# EAGLE board CoCoQuadLink (EAGLE 7.7.0)
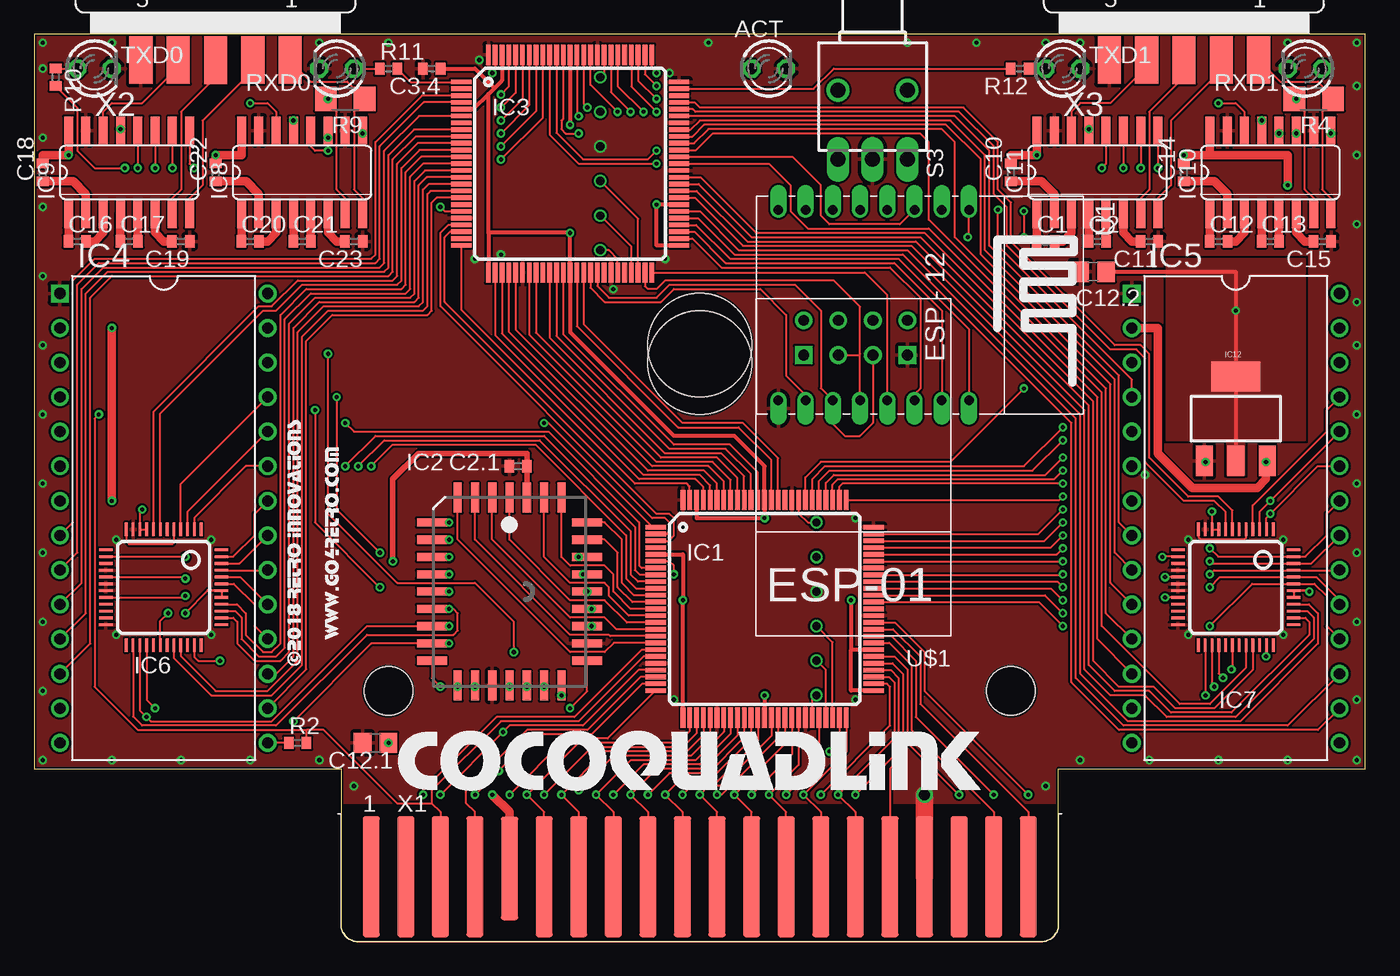
[diagram p7: board, top side]
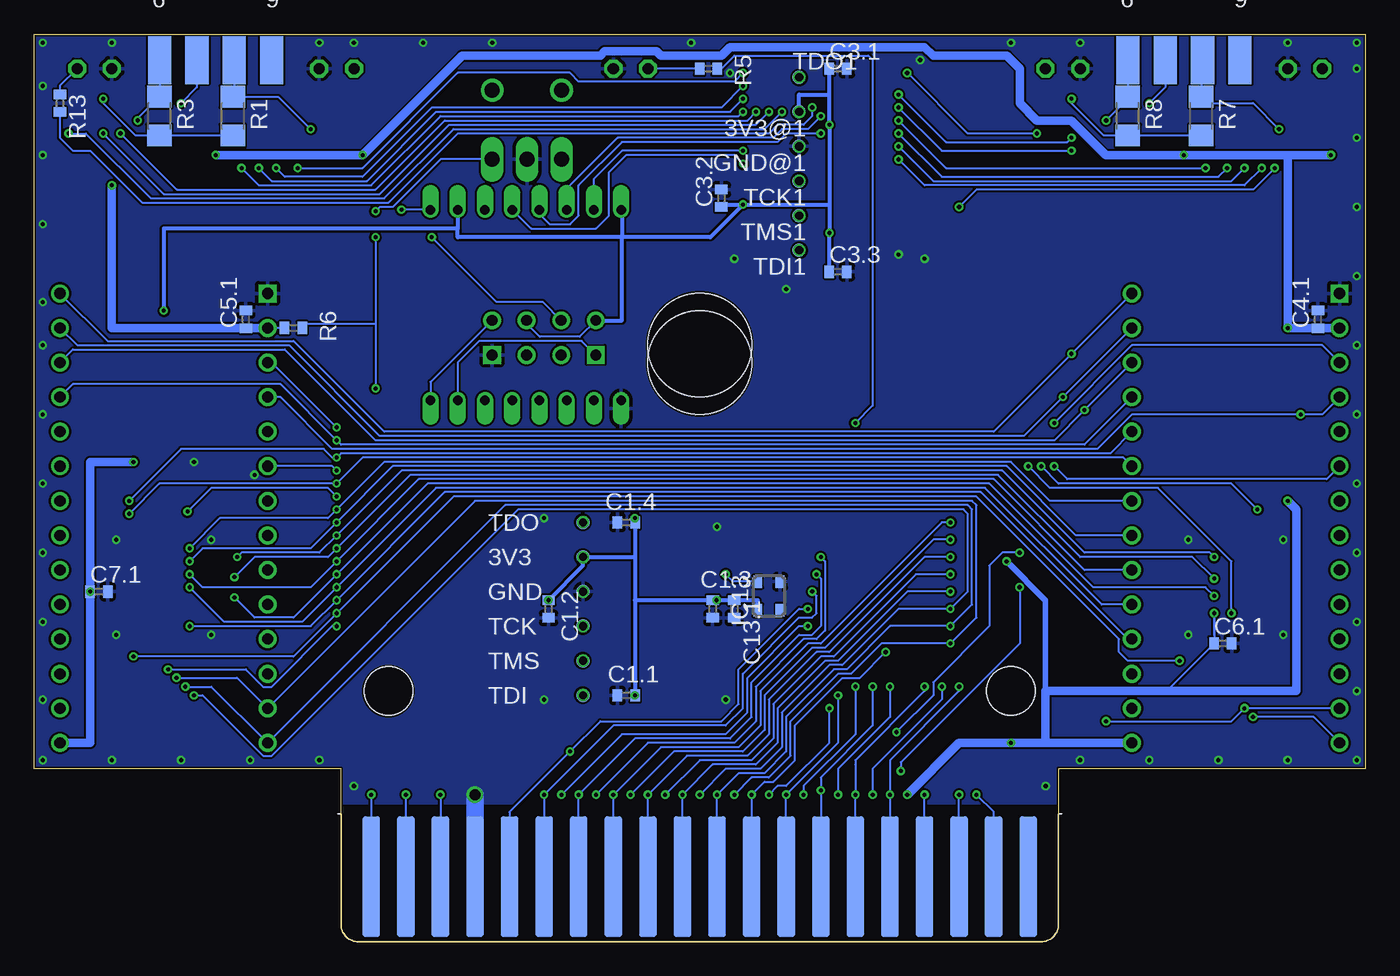
[diagram p8: board, bottom side, seen from below]

Size 97.79 x 66.67 mm. Coordinates in mm from the lower left corner, seen from the top.
Outline: 97.79,66.67 0,66.67 0,12.7 22.54,12.7 22.54,1.27 arc90 23.81,0 73.98,0 arc90 75.25,1.27 75.25,12.7 97.79,12.7 97.79,66.67
Copper layers (1*16): Top 0.035mm / dielectric 1.5mm / Bottom 0.035mm
Design rules "hackvana *": minimum track width 6mil, minimum drill 0.3mm, track to track 6mil, track to pad 6mil, pad to pad 6mil, via to via 6mil, smd to smd 0mil, copper to edge 6mil, drill to drill 6mil, minimum pad ring 10mil, minimum via ring 6mil, stop-mask expansion 2mil, vias tented up to drill 100mil, thermal gap 10mil

## Footprints (pad centres in the part's own frame; a part is rotated, then mirrored left to right if it is on the bottom)
TP10R = smd 1 x 1: TP 0,0
LED3MM = drill 0.813 octagon: A -1.27,0; K 1.27,0
C0402 = smd 0.7 x 0.9: 1 -0.65,0; 2 0.65,0
C0805 = smd 1.3 x 1.5: 1 -0.95,0; 2 0.95,0
TQFP100 = smd 1.5 x 0.35: 1 -8,6; 2 -8,5.5; 3 -8,5; 4 -8,4.5; 5 -8,4; 6 -8,3.5; 7 -8,3; 8 -8,2.5; 9 -8,2; 10 -8,1.5; 11 -8,1; 12 -8,0.5; 13 -8,0; 14 -8,-0.5; 15 -8,-1; 16 -8,-1.5; 17 -8,-2; 18 -8,-2.5; 19 -8,-3; 20 -8,-3.5; 21 -8,-4; 22 -8,-4.5; 23 -8,-5; 24 -8,-5.5; 25 -8,-6; 51 8,-6; 52 8,-5.5; 53 8,-5; 54 8,-4.5; 55 8,-4; 56 8,-3.5; 57 8,-3; 58 8,-2.5; 59 8,-2; 60 8,-1.5; 61 8,-1; 62 8,-0.5; 63 8,0; 64 8,0.5; 65 8,1; 66 8,1.5; 67 8,2; 68 8,2.5; 69 8,3; 70 8,3.5; 71 8,4; 72 8,4.5; 73 8,5; 74 8,5.5; 75 8,6 | smd 0.35 x 1.5: 26 -6,-8; 27 -5.5,-8; 28 -5,-8; 29 -4.5,-8; 30 -4,-8; 31 -3.5,-8; 32 -3,-8; 33 -2.5,-8; 34 -2,-8; 35 -1.5,-8; 36 -1,-8; 37 -0.5,-8; 38 0,-8; 39 0.5,-8; 40 1,-8; 41 1.5,-8; 42 2,-8; 43 2.5,-8; 44 3,-8; 45 3.5,-8; 46 4,-8; 47 4.5,-8; 48 5,-8; 49 5.5,-8; 50 6,-8; 76 6,8; 77 5.5,8; 78 5,8; 79 4.5,8; 80 4,8; 81 3.5,8; 82 3,8; 83 2.5,8; 84 2,8; 85 1.5,8; 86 1,8; 87 0.5,8; 88 0,8; 89 -0.5,8; 90 -1,8; 91 -1.5,8; 92 -2,8; 93 -2.5,8; 94 -3,8; 95 -3.5,8; 96 -4,8; 97 -4.5,8; 98 -5,8; 99 -5.5,8; 100 -6,8
PLCC32R = smd 0.6 x 2.2: 1 0,6.9; 2 -1.27,6.9; 3 -2.54,6.9; 4 -3.81,6.9; 14 -3.81,-6.9; 15 -2.54,-6.9; 16 -1.27,-6.9; 17 0,-6.9; 18 1.27,-6.9; 19 2.54,-6.9; 20 3.81,-6.9; 30 3.81,6.9; 31 2.54,6.9; 32 1.27,6.9 | smd 2.2 x 0.6: 5 -5.7,5.08; 6 -5.7,3.81; 7 -5.7,2.54; 8 -5.7,1.27; 9 -5.7,0; 10 -5.7,-1.27; 11 -5.7,-2.54; 12 -5.7,-3.81; 13 -5.7,-5.08; 21 5.7,-5.08; 22 5.7,-3.81; 23 5.7,-2.54; 24 5.7,-1.27; 25 5.7,0; 26 5.7,1.27; 27 5.7,2.54; 28 5.7,3.81; 29 5.7,5.08
DIL28-ROUNDPAD = drill 0.813 square: 1 -16.51,-7.62 | drill 0.813: 2 -13.97,-7.62; 3 -11.43,-7.62; 4 -8.89,-7.62; 5 -6.35,-7.62; 6 -3.81,-7.62; 7 -1.27,-7.62; 8 1.27,-7.62; 9 3.81,-7.62; 10 6.35,-7.62; 11 8.89,-7.62; 12 11.43,-7.62; 13 13.97,-7.62; 14 16.51,-7.62; 15 16.51,7.62; 16 13.97,7.62; 17 11.43,7.62; 18 8.89,7.62; 19 6.35,7.62; 20 3.81,7.62; 21 1.27,7.62; 22 -1.27,7.62; 23 -3.81,7.62; 24 -6.35,7.62; 25 -8.89,7.62; 26 -11.43,7.62; 27 -13.97,7.62; 28 -16.51,7.62
LQFP48 = smd 0.2 x 1: 1 -2.75,-4.25; 2 -2.25,-4.25; 3 -1.75,-4.25; 4 -1.25,-4.25; 5 -0.75,-4.25; 6 -0.25,-4.25; 7 0.25,-4.25; 8 0.75,-4.25; 9 1.25,-4.25; 10 1.75,-4.25; 11 2.25,-4.25; 12 2.75,-4.25; 25 2.75,4.25; 26 2.25,4.25; 27 1.75,4.25; 28 1.25,4.25; 29 0.75,4.25; 30 0.25,4.25; 31 -0.25,4.25; 32 -0.75,4.25; 33 -1.25,4.25; 34 -1.75,4.25; 35 -2.25,4.25; 36 -2.75,4.25 | smd 1 x 0.2: 13 4.25,-2.75; 14 4.25,-2.25; 15 4.25,-1.75; 16 4.25,-1.25; 17 4.25,-0.75; 18 4.25,-0.25; 19 4.25,0.25; 20 4.25,0.75; 21 4.25,1.25; 22 4.25,1.75; 23 4.25,2.25; 24 4.25,2.75; 37 -4.25,2.75; 38 -4.25,2.25; 39 -4.25,1.75; 40 -4.25,1.25; 41 -4.25,0.75; 42 -4.25,0.25; 43 -4.25,-0.25; 44 -4.25,-0.75; 45 -4.25,-1.25; 46 -4.25,-1.75; 47 -4.25,-2.25; 48 -4.25,-2.75
SO16 = smd 0.66 x 2.032: 1 -4.445,-3.073; 2 -3.175,-3.073; 3 -1.905,-3.073; 4 -0.635,-3.073; 5 0.635,-3.073; 6 1.905,-3.073; 7 3.175,-3.073; 8 4.445,-3.073; 9 4.445,3.073; 10 3.175,3.073; 11 1.905,3.073; 12 0.635,3.073; 13 -0.635,3.073; 14 -1.905,3.073; 15 -3.175,3.073; 16 -4.445,3.073
SOT223 = smd 1.219 x 2.235: 1 -2.311,-3.099; 2 0,-3.099; 3 2.311,-3.099 | smd 3.6 x 2.2: 4 0,3.099
ASE = smd 0.9 x 0.65: 1 -1.05,-0.825; 2 1.05,-0.825; 3 1.05,0.825; 4 -1.05,0.825
PROGRAM_PAK = hole 7.62: 0,1.27; 0,0 | hole 3.556: -22.86,-24.13; 22.86,-24.13
R1206 = smd 1.6 x 1.803: 1 -1.422,0; 2 1.422,0
R0402 = smd 0.7 x 0.9: 1 -0.65,0; 2 0.65,0
TL3XWO = drill 1.1 pad 1.422 long: 1 -2.54,-5.08; 2 0,-5.08; 3 2.54,-5.08 | drill 1.1 pad 1.676: M1 -2.54,0; M2 2.54,0
ESP12 = drill 0.7 offset: ADC -7.1,3.8; CH_PD -7.1,1.8; GND 6.9,-8.2; GPIO0 6.9,-2.2; GPIO2 6.9,-4.2; GPIO4 6.9,1.8; GPIO5 6.9,-0.2; GPIO12 -7.1,-4.2; GPIO13 -7.1,-6.2; GPIO14 -7.1,-2.2; GPIO15 6.9,-6.2; GPIO16 -7.1,-0.2; RESET -7.1,5.8; RX 6.9,3.8; TX 6.9,5.8; VCC -7.1,-8.2
ESP01 = drill 0.8: CH_PD -1.285,-8.178; GPIO0 1.255,-5.638; GPIO2 -1.285,-5.638; RST 1.255,-8.178; TX -3.825,-8.178; VCC 3.795,-8.178 | drill 0.8 square: GND -3.825,-5.638; RX 3.795,-5.638
MA20-2 = smd 1.27 x 8.89: 1 -24.13,-0.305; 3 -21.59,-0.305; 5 -19.05,-0.305; 7 -16.51,-0.305; 11 -11.43,-0.305; 13 -8.89,-0.305; 15 -6.35,-0.305; 17 -3.81,-0.305; 19 -1.27,-0.305; 21 1.27,-0.305; 23 3.81,-0.305; 25 6.35,-0.305; 27 8.89,-0.305; 29 11.43,-0.305; 31 13.97,-0.305; 33 16.51,-0.305; 35 19.05,-0.305; 37 21.59,-0.305; 39 24.13,-0.305 | smd 1.27 x 8.89 bottom: 2 -24.13,-0.305; 4 -21.59,-0.305; 6 -19.05,-0.305; 8 -16.51,-0.305; 10 -13.97,-0.305; 12 -11.43,-0.305; 14 -8.89,-0.305; 16 -6.35,-0.305; 18 -3.81,-0.305; 20 -1.27,-0.305; 22 1.27,-0.305; 24 3.81,-0.305; 26 6.35,-0.305; 28 8.89,-0.305; 30 11.43,-0.305; 32 13.97,-0.305; 34 16.51,-0.305; 36 19.05,-0.305; 38 21.59,-0.305; 40 24.13,-0.305 | smd 1.27 x 7.62: 9 -13.97,0.305
M09D = smd 1.7 x 3.5: 1 5.486,-6.045; 2 2.743,-6.045; 3 0,-6.045; 4 -2.743,-6.045; 5 -5.486,-6.045 | smd 1.7 x 3.5 bottom: 6 4.115,-6.045; 7 1.372,-6.045; 8 -1.372,-6.045; 9 -4.115,-6.045

## Placement (x,y rotation side)
3V3  TPTP10R  [TP10R]  57.47,28.26 90 bottom
3V3@1  TPTP10R  [TP10R]  41.59,60.96 180 bottom
ACT  [LED3MM]  53.98,64.14 0 top
C1  0.1uf  [C0402]  74.3,51.44 0 top
C1.1  .1  [C0402]  54.29,18.1 180 bottom
C1.2  .1  [C0402]  60.01,24.45 270 bottom
C1.3  .1  [C0402]  47.94,24.45 270 bottom
C1.4  .1  [C0402]  54.29,30.8 180 bottom
C2  0.1uf  [C0402]  78.11,51.44 0 top
C2.1  .1  [C0402]  35.56,34.92 180 top
C3.1  .1  [C0402]  38.73,64.14 0 bottom
C3.2  .1  [C0402]  47.31,54.61 90 bottom
C3.3  .1  [C0402]  38.73,49.21 0 bottom
C3.4  .1  [C0402]  29.21,64.14 180 top
C4.1  .1  [C0402]  3.49,45.72 90 bottom
C5.1  .1  [C0402]  82.23,45.72 90 bottom
C6.1  .1  [C0402]  10.48,21.91 0 bottom
C7.1  .1  [C0402]  93.03,25.72 0 bottom
C10  0.1uF  [C0402]  71.75,56.52 90 top
C11  0.1uf  [C0402]  81.92,51.44 180 top
C12  0.1uf  [C0402]  87,51.44 0 top
C12.1  10  [C0805]  25.08,14.61 180 top
C12.2  22  [C0805]  77.79,49.21 180 top
C13  0.1uf  [C0402]  90.81,51.44 0 top
C13.1  .1  [C0402]  46.36,24.45 270 bottom
C14  0.1uF  [C0402]  84.46,56.52 90 top
C15  0.1uf  [C0402]  94.62,51.44 180 top
C16  0.1uf  [C0402]  3.18,51.44 0 top
C17  0.1uf  [C0402]  6.99,51.44 0 top
C18  0.1uF  [C0402]  0.64,56.52 90 top
C19  0.1uf  [C0402]  10.8,51.44 180 top
C20  0.1uf  [C0402]  15.88,51.44 0 top
C21  0.1uf  [C0402]  19.69,51.44 0 top
C22  0.1uF  [C0402]  13.34,56.52 90 top
C23  0.1uf  [C0402]  23.5,51.44 180 top
GND  TPTP10R  [TP10R]  57.47,25.72 90 bottom
GND@1  TPTP10R  [TP10R]  41.59,58.42 180 bottom
IC1  XC95144XLTQG100  [TQFP100]  53.66,24.45 0 top
IC2  AM29F040J  [PLCC32R]  34.93,25.72 0 top
IC3  XC9572XLTQG100  [TQFP100]  39.37,57.15 0 top
IC4  65X51A  [DIL28-ROUNDPAD]  9.53,31.11 270 top
IC5  65X51A  [DIL28-ROUNDPAD]  88.27,31.11 270 top
IC6  ST16C550  [LQFP48]  9.53,26.04 180 top
IC7  TL16C550  [LQFP48]  88.27,26.04 180 top
IC8  MAX232  [SO16]  19.69,56.52 0 top
IC9  MAX232  [SO16]  6.99,56.52 0 top
IC10  MAX232  [SO16]  90.81,56.52 0 top
IC11  MAX232  [SO16]  78.11,56.52 0 top
IC12  [SOT223]  88.27,38.42 0 top
IC13  ASE  [ASE]  43.82,25.4 90 bottom
PAK  [PROGRAM_PAK]  48.9,42.55 0 top
R1  4.7K  [R1206]  83.19,60.64 270 bottom
R2  10K  [R0402]  19.37,14.61 180 top
R3  4.7K  [R1206]  88.58,60.64 270 bottom
R4  4.7K  [R1206]  93.98,61.91 180 top
R5  [R0402]  48.26,64.14 0 bottom
R6  10K  [R0402]  78.74,45.09 180 bottom
R7  4.7K  [R1206]  12.07,60.64 270 bottom
R8  4.7K  [R1206]  17.46,60.64 270 bottom
R9  4.7K  [R1206]  22.86,61.91 180 top
R10  [R0402]  1.59,63.5 270 top
R11  [R0402]  26.04,64.14 0 top
R12  [R0402]  72.39,64.14 180 top
R13  [R0402]  95.89,61.59 270 bottom
RXD0  [LED3MM]  22.23,64.14 180 top
RXD1  [LED3MM]  93.34,64.14 180 top
S3  TL36WO  [TL3XWO]  61.59,62.55 0 top
TCK  TPTP10R  [TP10R]  57.47,23.18 90 bottom
TCK1  TPTP10R  [TP10R]  41.59,55.88 180 bottom
TDI  TPTP10R  [TP10R]  57.47,18.1 90 bottom
TDI1  TPTP10R  [TP10R]  41.59,50.8 180 bottom
TDO  TPTP10R  [TP10R]  57.47,30.8 90 bottom
TDO1  TPTP10R  [TP10R]  41.59,63.5 0 bottom
TMS  TPTP10R  [TP10R]  57.47,20.64 0 bottom
TMS1  TPTP10R  [TP10R]  41.59,53.34 180 bottom
TXD0  [LED3MM]  4.45,64.14 0 top
TXD1  [LED3MM]  75.56,64.14 0 top
U1  ESP-12e  [ESP12]  62.87,46.67 270 top
U$1  ESP01  [ESP01]  60.33,37.47 180 top
X1  EXPANSION_PORT_COCO  [MA20-2]  48.9,5.08 0 top
X2  [M09D]  13.34,70.8 0 top
X3  [M09D]  84.46,70.8 0 top

## Tracks (layer width: path | path; a pad name or v marks a point on that pad's centre or on a via)
!CART  (via drill 0.3)
  Top 0.152: IC1.24 44.67,18.95 40.96,15.24 36.83,15.24 v34.13,12.54 v32.39,10.79 | v20.64,39.05 20.64,30.8 v25.4,26.04
  Bottom 0.152: X1.8 v32.39,10.79 | IC5.26 94.93,43.5 79.38,43.5 72.71,36.83 22.86,36.83 v20.64,39.05 IC4.26 | v25.4,26.04 25.4,21.91 34.13,13.18 v34.13,12.54 34.13,12.86
!CE_UART0  (via drill 0.3)
  Top 0.152: v22.86,38.1 23.5,37.47 37.78,37.47 44.45,30.8 44.45,27.62 44.62,27.45 IC1.7
  Bottom 0.152: IC4.3 3.18,43.81 17.15,43.81 v22.86,38.1
!CE_UART1  (via drill 0.3)
  Top 0.152: IC1.81 57.16,33.98 58.1,34.92 72.71,34.92 v75.56,37.78
  Bottom 0.152: IC5.3 80.33,42.55 v75.56,37.78
!CTS  (via drill 0.3)
  Top 0.152: IC2.24 v40.96,24.45 | IC1.49 59.16,14.71 v58.42,13.97
  Bottom 0.152: X1.32 62.87,9.53 v58.42,13.97 56.2,16.19 47.31,16.19 46.04,17.46 46.04,20 41.59,24.45 v40.96,24.45
!CTS0  (via drill 0.3)
  Top 0.152: IC9.12 v7.62,56.83 | v34.29,57.47 37.37,60.55 IC3.92
  Bottom 0.152: v7.62,56.83 8.89,55.56 32.39,55.56 v34.29,57.47
!CTS1  (via drill 0.3)
  Top 0.152: IC11.12 78.74,57.15 v78.42,56.83 | IC3.76 45.37,64.17 v45.72,63.82
  Bottom 0.152: v78.42,56.83 73.66,56.83 66.68,63.82 58.42,63.82 57.79,63.18 46.36,63.18 v45.72,63.82
!DCD0  (via drill 0.3)
  Top 0.152: IC3.99 33.87,64.03 v33.66,63.82 | v24.13,59.37 IC8.9
  Bottom 0.152: v24.13,59.37 29.21,59.37 v33.66,63.82
!DCD1  (via drill 0.3)
  Top 0.152: v42.86,60.96 40.87,62.95 IC3.85 | v95.25,59.37 IC10.9
  Bottom 0.152: v95.25,59.37 93.98,59.37 89.22,54.61 72.07,54.61 66.99,59.69 44.13,59.69 v42.86,60.96
!DSR0  (via drill 0.3)
  Top 0.152: IC3.96 35.37,62.36 v34.29,61.28 | v21.59,58.1 20.64,58.1 20.32,58.42 IC8.12
  Bottom 0.152: v34.29,61.28 31.12,58.1 v21.59,58.1
!DSR1  (via drill 0.3)
  Top 0.152: IC10.12 v91.44,59.37 | v44.77,60.96 42.87,62.86 IC3.81
  Bottom 0.152: v91.44,59.37 87.31,55.24 72.71,55.24 67.63,60.33 45.4,60.33 v44.77,60.96
!DTR0  (via drill 0.3)
  Top 0.152: IC9.11 v8.89,56.83 | IC3.93 36.87,61 v34.29,58.42
  Bottom 0.152: v8.89,56.83 9.84,55.88 31.75,55.88 v34.29,58.42
!DTR1  (via drill 0.3)
  Top 0.152: IC11.11 v80.01,56.83 | IC3.77 44.87,63.72 v45.72,62.87
  Bottom 0.152: v45.72,62.87 47.31,61.28 68.58,61.28 73.66,56.2 79.38,56.2 v80.01,56.83
!FWE
  Top 0.152: IC1.14 43.68,23.95 42.23,25.4 42.23,26.04 41.91,26.35 39.37,26.35 37.47,28.26 IC2.31
!NMI  (via drill 0.3)
  Top 0.152: IC1.19 44.62,21.45 39.69,16.51 33.97,16.51 28.58,11.11 v28.58,10.79
  Bottom 0.152: X1.4 27.31,9.53 v28.58,10.79
!RESET  (via drill 0.3)
  Top 0.152: 29.21,10.16 29.21,11.11 34.29,16.19 40.01,16.19 44.76,20.95 IC1.20 | 29.21,10.16 29.85,9.53 X1.5 | 20.02,15.56 7.62,15.56 4.45,18.73 4.45,38.42 v4.76,38.73 | 29.21,10.16 26.67,10.16 21.27,15.56 20.02,15.56 | R2.1 20.02,15.56 | IC5.4 80.65,41.27 70.8,51.12 v70.8,53.77 | v68.58,51.75 68.67,51.84 U1.RESET
  Bottom 0.152: IC4.4 3.18,38.73 v4.76,38.73 17.15,38.73 19.69,36.2 75.88,36.2 79.69,40.01 IC5.4 | U1.RESET v70.8,53.77 | U$1.RST 60.42,46.99 63.82,46.99 v68.58,51.75
!RTS0  (via drill 0.3)
  Top 0.152: IC8.11 v21.59,59.05 | IC3.97 34.87,62.81 v34.29,62.23
  Bottom 0.152: v34.29,62.23 30.8,58.74 21.91,58.74 v21.59,59.05
!RTS1  (via drill 0.3)
  Top 0.152: IC10.11 v92.71,59.37 | v43.82,60.96 42.37,62.41 IC3.82
  Bottom 0.152: v92.71,59.37 88.27,54.93 72.39,54.93 67.31,60.01 44.77,60.01 v43.82,60.96
!SCS  (via drill 0.3)
  Top 0.152: IC1.56 63.19,20.95 64.14,20 64.14,14.61 v67.95,10.79
  Bottom 0.152: v67.95,10.79 X1.36
!SLENB  (via drill 0.3)
  Top 0.152: IC1.61 63.23,23.45 65.41,21.27 65.41,18.41 v73.03,10.79
  Bottom 0.152: v73.03,10.79 X1.40
!UART_CTS0
  Top 0.152: IC4.9 3.18,28.57 3.18,48.26 4.76,49.85 25.08,49.85 25.4,50.16 25.4,58.42 28.63,61.65 IC3.4
!UART_CTS1
  Top 0.152: IC5.9 79.38,28.57 79.38,41.27 69.85,50.8 69.85,57.78 67.31,60.33 48.9,60.33 48.22,59.65 IC3.68
!UART_CTS2
  Top 0.152: IC6.38 14.63,23.79 14.92,23.5 14.92,21.91 16.19,20.64 18.1,20.64 18.73,21.27 18.73,45.4 20.64,47.31 27.62,47.31 27.94,47.62 27.94,55.88 28.71,56.65 IC3.14
!UART_CTS3
  Top 0.152: IC7.38 93.37,23.79 93.66,23.5 93.66,22.54 87.95,16.83 83.5,16.83 81.92,18.41 79.38,18.41 77.47,20.32 77.47,39.37 65.09,51.75 52.71,51.75 48.81,55.65 IC3.60
!UART_DCD0
  Top 0.152: IC4.16 20,20 20,44.13 21.91,46.04 28.89,46.04 29.21,46.35 29.21,54.29 29.57,54.65 IC3.18
!UART_DCD1
  Top 0.152: IC5.16 94.3,15.56 79.69,15.56 76.2,19.05 76.2,38.1 63.82,50.48 51.44,50.48 48.77,53.15 IC3.55
!UART_DCD2
  Top 0.152: IC6.40 14.9,24.79 15.56,24.13 15.56,22.54 16.83,21.27 17.46,21.27 18.1,21.91 18.1,46.04 20,47.94 26.99,47.94 27.31,48.26 27.31,56.52 28.44,57.65 IC3.12
!UART_DCD3
  Top 0.152: IC7.40 93.64,24.79 94.3,24.13 94.3,21.91 88.58,16.19 80.33,16.19 76.84,19.68 76.84,38.73 64.45,51.12 52.07,51.12 48.54,54.65 IC3.58
!UART_DSR0
  Top 0.152: IC4.17 17.78,19.68 19.05,20.95 19.05,45.09 20.96,46.99 27.94,46.99 28.26,47.31 28.26,55.56 28.85,56.15 IC3.15
!UART_DSR1
  Top 0.152: IC5.17 92.08,15.88 80.01,15.88 76.52,19.37 76.52,38.42 64.14,50.8 51.75,50.8 48.9,53.65 IC3.56
!UART_DSR2
  Top 0.152: IC6.39 14.77,24.29 15.24,23.81 15.24,22.23 16.51,20.95 17.78,20.95 18.42,21.59 18.42,45.72 20.32,47.62 27.31,47.62 27.62,47.94 27.62,56.2 28.58,57.15 IC3.13
!UART_DSR3
  Top 0.152: IC7.39 93.51,24.29 93.98,23.81 93.98,22.23 88.27,16.51 83.19,16.51 81.6,18.1 79.06,18.1 77.15,20 77.15,39.05 64.77,51.44 52.39,51.44 48.67,55.15 IC3.59
!UART_DTR0
  Top 0.152: IC4.11 3.81,24.13 3.81,47.62 5.4,49.21 25.72,49.21 26.04,49.53 26.04,57.78 27.9,59.65 IC3.8
!UART_DTR1
  Top 0.152: IC5.11 78.74,24.13 78.74,40.64 67.63,51.75 67.63,58.74 66.68,59.69 49.53,59.69 48.49,58.65 IC3.66
!UART_DTR2
  Top 0.152: IC6.33 10.78,20.98 13.34,18.41 17.15,18.41 19.37,20.64 19.37,44.77 21.27,46.67 28.26,46.67 28.58,46.99 28.58,55.24 28.98,55.65 IC3.16
!UART_DTR3
  Top 0.152: IC7.33 89.52,19.98 86.68,17.14 83.82,17.14 82.23,18.73 79.69,18.73 77.79,20.64 77.79,39.69 65.41,52.07 53.02,52.07 48.94,56.15 IC3.61
!UART_RTS0
  Top 0.152: IC4.8 2.86,30.8 2.86,48.58 4.45,50.16 24.77,50.16 25.08,50.48 25.08,58.74 28.5,62.15 IC3.3
!UART_RTS1
  Top 0.152: IC5.8 79.69,30.8 79.69,41.59 70.17,51.12 70.17,58.1 67.62,60.65 IC3.70
!UART_RTS2
  Top 0.152: IC6.32 10.28,20.84 13.02,18.1 17.46,18.1 19.69,20.32 19.69,44.45 21.59,46.35 28.58,46.35 28.89,46.67 28.89,54.93 29.12,55.15 IC3.17
!UART_RTS3
  Top 0.152: IC7.32 89.02,20.12 86.36,17.46 84.14,17.46 78.42,23.18 78.42,40.32 65.72,53.02 65.72,58.74 65.09,59.37 49.85,59.37 48.62,58.15 IC3.65
!UART_RXD3
  Top 0.152: IC7.7 88.02,31.68 87,32.7 84.77,32.7 81.92,35.56 81.92,43.18 81.28,43.81 79.38,43.81 71.75,51.44 71.75,54.29 70.8,55.24 70.8,58.74 68.26,61.28 48.9,61.28 48.52,61.65 IC3.72
!UART_TXD3
  Top 0.152: IC7.8 87.52,31.55 86.68,32.38 84.46,32.38 81.6,35.24 81.6,42.86 80.96,43.5 79.06,43.5 71.44,51.12 71.44,53.98 70.48,54.93 70.48,58.42 67.95,60.96 48.58,60.96 48.39,61.15 IC3.71
+3V3  (via drill 0.3, 0.6, 0.61)
  Top 0.305: v53.66,18.1 IC1.38 | IC1.51 60.01,18.45 60.01,21.45 | IC1.57 60.01,21.45 | v60.01,25.08 60.01,21.45 | IC1.5 47.66,28.45 v47.66,25.08 IC1.26 | IC1.98 48.66,31.11 53.64,31.11 | 53.64,31.11 53.64,31.18 | IC3.98 34.37,63.26 33.81,62.71 | 33.37,62.26 32.26,61.15 IC3.5 | IC3.88 v39.37,60.01 | IC3.57 v45.72,54.15 45.72,51.15 IC3.51 | 33.37,52.07 v39.37,52.07 IC3.38 39.37,44.77 46.99,37.15 51.44,37.15 53.66,34.92 IC1.88 v53.66,31.11 53.64,31.11 | 33.37,52.07 IC3.26 | 33.37,52.07 33.37,62.26 | 33.37,62.26 33.81,62.71 | C3.4.1 32.39,64.14 33.81,62.71 | IC12.2 v88.27,46.35 88.27,49.21 C12.2.1
  Bottom 0.152: U$1.VCC 57.72,44.45 60.64,44.45 61.61,45.42 U$1.CH_PD | C13.1.1 46.36,25.08
  Bottom 0.305: C1.4.1 53.66,30.8 v53.66,31.11 53.66,28.26 | C1.2.1 v60.01,25.08 57.47,27.62 3V3.TP 53.66,28.26 | C1.1.1 v53.66,18.1 53.66,25.08 | 47.66,25.1 v47.66,25.08 | 53.66,28.26 53.66,25.08 | 47.94,25.08 53.66,25.08 | v47.66,25.08 47.94,25.08 | 47.94,25.08 C1.3.1 | 39.37,54.15 v39.37,60.01 39.37,62.23 | 39.37,54.15 v39.37,52.07 39.37,49.21 C3.3.1 | C3.2.1 47.12,54.15 45.86,54.15 | 54.61,51.75 48.12,51.75 v45.72,54.15 | 54.61,51.75 66.68,51.75 66.68,52.39 | 66.68,52.39 88.27,52.39 v88.27,46.35 | 45.86,54.15 45.72,54.01 | v45.72,54.15 39.37,54.15 | 45.86,54.15 v45.72,54.15 | 39.37,62.23 39.37,64.14 C3.1.1 | U1.ADC 66.68,52.39 | 3V3@1.TP 41.59,62.23 39.37,62.23 | U1.VCC 54.61,53.72 54.61,51.75 | U$1.VCC 54.61,45.64 54.61,51.75 | IC13.4 44.64,25.08 46.36,25.08 v47.66,25.08
  other vias: 57.47,28.26 41.59,60.96
  pour Top (no thermals): 87.63,34.29 87.63,36.83 83.19,36.83 83.19,50.16 93.34,50.16 93.34,36.83 88.9,36.83 88.9,34.29
A0  (via drill 0.3)
  Top 0.152: X1.19 47.62,9.53 v46.36,10.79 47.62,12.06 49.85,12.06 52.66,14.88 IC1.36 | v30.48,21.91 IC2.12 24.77,21.91 v19.05,16.19 | IC6.28 8.28,17.76 v8.89,17.14 | IC7.28 87.02,19.7 v87.33,19.39
  Bottom 0.152: v46.36,10.79 45.09,12.06 43.82,12.06 42.23,13.65 42.23,16.19 38.73,19.68 37.78,19.68 35.56,21.91 v30.48,21.91 28.58,23.81 28.58,32.07 28.89,32.38 65.41,32.38 IC5.13 82.89,19.39 v87.33,19.39 | IC4.13 v8.89,17.14 9.84,16.19 v19.05,16.19
A1  (via drill 0.3)
  Top 0.152: v30.48,23.18 IC2.11 24.45,23.18 17.46,16.19 8.57,16.19 v8.26,16.51 7.78,16.99 IC6.27 | v47.62,10.79 48.58,11.75 50.17,11.75 53.16,14.74 IC1.37 | IC7.27 86.52,18.89 v86.68,18.73
  Bottom 0.152: X1.20 v47.62,10.79 46.04,12.38 44.13,12.38 42.55,13.97 42.55,16.51 39.05,20 38.1,20 34.93,23.18 v30.48,23.18 28.89,24.77 28.89,31.75 29.21,32.07 63.18,32.07 IC5.14 84.77,18.73 v86.68,18.73 | IC4.14 3.81,16.51 v8.26,16.51
A2  (via drill 0.3)
  Top 0.152: X1.21 50.17,9.53 v48.9,10.79 49.53,11.43 50.48,11.43 54.16,15.11 IC1.39 | IC2.10 v30.48,24.45 30.8,24.45 31.12,24.13 31.12,22.86 30.8,22.54 24.45,22.54 17.78,15.88 7.94,15.88 7.28,16.54 IC6.26 | IC7.26 86.02,18.12 v86.04,18.1
  Bottom 0.152: v48.9,10.79 46.99,12.7 44.45,12.7 42.86,14.29 42.86,16.83 39.37,20.32 38.42,20.32 34.29,24.45 v30.48,24.45 29.21,25.72 29.21,31.43 29.53,31.75 62.23,31.75 80.33,13.65 80.96,13.65 85.41,18.1 v86.04,18.1
A3  (via drill 0.3)
  Top 0.152: IC2.9 v30.48,25.72 | v50.17,10.79 50.48,10.79 54.66,14.97 IC1.40
  Bottom 0.152: X1.22 v50.17,10.79 47.94,13.02 44.77,13.02 43.18,14.61 43.18,17.14 39.69,20.64 38.73,20.64 33.66,25.72 v30.48,25.72
A4  (via drill 0.3)
  Top 0.152: X1.23 52.71,9.53 v51.44,10.79 55.16,14.52 IC1.41 | IC2.8 v30.48,26.99
  Bottom 0.152: v30.48,26.99 33.02,26.99 39.05,20.95 40.01,20.95 43.5,17.46 43.5,14.92 45.09,13.34 48.9,13.34 v51.44,10.79
A5  (via drill 0.3)
  Top 0.152: IC2.7 v30.48,28.26 | IC1.42 55.66,13.75 v52.71,10.79
  Bottom 0.152: X1.24 v52.71,10.79 49.85,13.65 45.4,13.65 43.82,15.24 43.82,17.78 40.32,21.27 39.37,21.27 32.39,28.26 v30.48,28.26
A6  (via drill 0.3)
  Top 0.152: X1.25 55.25,9.53 v53.98,10.79 56.16,12.98 IC1.43 | IC2.6 v30.48,29.53
  Bottom 0.152: v30.48,29.53 31.75,29.53 39.69,21.59 40.64,21.59 44.13,18.1 44.13,15.56 45.72,13.97 50.8,13.97 v53.98,10.79
A7  (via drill 0.3)
  Top 0.152: IC2.5 v30.48,30.8 | IC1.46 57.66,13.21 v55.25,10.79
  Bottom 0.152: X1.26 v55.25,10.79 51.75,14.29 46.04,14.29 44.45,15.88 44.45,18.41 40.96,21.91 40.01,21.91 31.12,30.8 v30.48,30.8
A8  (via drill 0.3)
  Top 0.152: X1.27 57.79,9.53 v56.52,10.79 59.66,13.94 IC1.50 | IC2.27 v40.01,28.26
  Bottom 0.152: v40.01,28.26 39.69,27.94 39.69,22.86 40.32,22.23 41.28,22.23 44.77,18.73 44.77,16.19 46.36,14.61 52.71,14.61 v56.52,10.79
A9  (via drill 0.3)
  Top 0.152: IC2.26 v40.32,26.99 | v57.79,10.79 62.87,15.88 62.87,18.73 62.65,18.95 IC1.52
  Bottom 0.152: X1.28 v57.79,10.79 53.66,14.92 46.67,14.92 45.09,16.51 45.09,19.05 41.59,22.54 40.64,22.54 40.01,23.18 40.01,26.67 v40.32,26.99
A10  (via drill 0.3)
  Top 0.152: X1.29 60.33,9.53 v59.06,10.79 63.18,14.92 63.18,19.05 62.79,19.45 IC1.53 | IC2.23 v40.96,23.18
  Bottom 0.152: v59.06,10.79 54.61,15.24 46.99,15.24 45.4,16.83 45.4,19.37 41.59,23.18 v40.96,23.18
A11  (via drill 0.3)
  Top 0.152: IC2.25 v40.64,25.72 | IC1.54 62.92,19.95 63.5,19.37 63.5,13.97 v60.33,10.79
  Bottom 0.152: X1.30 v60.33,10.79 55.25,15.88 46.99,15.88 45.72,17.14 45.72,19.68 41.59,23.81 40.64,23.81 40.32,24.13 40.32,25.4 v40.64,25.72
A12
  Top 0.152: IC1.55 63.06,20.45 63.82,19.68 63.82,13.65 62.87,12.7 X1.31
A13
  Top 0.152: X1.37 70.48,9.53 64.45,15.56 64.45,20.32 62.83,21.95 IC1.58
A14  (via drill 0.3)
  Top 0.152: IC1.59 62.96,22.45 64.77,20.64 64.77,16.51 v70.48,10.79
  Bottom 0.152: v70.48,10.79 X1.38
A15
  Top 0.152: X1.39 73.03,9.53 65.09,17.46 65.09,20.95 63.09,22.95 IC1.60
BD0  (via drill 0.3)
  Top 0.152: IC6.43 14.67,26.29 16.19,24.77 16.19,23.18 IC4.18 | IC5.18 94.93,23.18 94.93,25.4 94.05,26.29 IC7.43 89.47,26.29 v86.36,23.18 | IC1.66 74.7,25.95 v75.56,25.08
  Bottom 0.152: v86.36,23.18 77.47,23.18 v75.56,25.08 67.63,33.02 28.26,33.02 17.46,22.23 IC4.18
BD1  (via drill 0.3)
  Top 0.152: IC6.44 15.12,26.79 IC4.19 | IC5.19 95.89,25.08 94.18,26.79 IC7.44 87.11,26.79 v86.36,26.04 | IC1.67 75.15,26.45 v75.56,26.04
  Bottom 0.152: IC4.19 19.37,24.77 27.94,33.34 68.26,33.34 v75.56,26.04 78.11,23.5 83.82,23.5 v86.36,26.04
BD2  (via drill 0.3)
  Top 0.152: IC6.45 17.13,27.29 IC4.20 | IC5.20 95.87,27.29 IC7.45 86.66,27.29 v86.36,26.99 | IC1.70 v75.56,27.95 v75.56,27.94
  Bottom 0.152: IC4.20 20.64,27.3 27.31,33.97 69.53,33.97 v75.56,27.94 77.47,26.04 85.41,26.04 v86.36,26.99
BD3  (via drill 0.3)
  Top 0.152: IC6.46 15.09,27.79 IC4.21 | IC5.21 93.83,27.79 IC7.46 86.52,27.79 v86.36,27.94 | IC1.73 74.22,29.45 v75.56,30.8
  Bottom 0.152: IC4.21 21.27,29.84 26.35,34.92 71.44,34.92 v75.56,30.8 77.47,28.89 85.41,28.89 v86.36,27.94
BD4  (via drill 0.3)
  Top 0.152: IC6.47 14.63,28.29 16.19,29.84 16.19,31.43 IC4.22 | IC5.22 94.93,31.43 94.93,29.84 93.37,28.29 IC7.47 86.97,28.29 v86.36,28.89 | IC1.74 73.76,29.95 v75.56,31.75
  Bottom 0.152: IC4.22 23.18,32.38 26.04,35.24 72.07,35.24 v75.56,31.75 76.2,31.11 84.14,31.11 v86.36,28.89
BD5  (via drill 0.3)
  Top 0.152: IC4.23 15.56,34.92 11.78,31.14 IC6.2 | IC7.2 90.52,31.14 v90.81,31.43 94.3,34.92 IC5.23 | v75.56,33.66 59.37,33.66 59.16,33.44 IC1.77
  Bottom 0.152: IC4.23 17.78,35.56 73.66,35.56 v75.56,33.66 88.58,33.66 v90.81,31.43
BD6  (via drill 0.3)
  Top 0.152: IC6.3 11.28,31.59 IC4.24 | IC7.3 90.02,31.59 v90.81,32.38 IC5.24 | IC1.79 58.16,33.71 58.74,34.29 74.3,34.29 v75.56,35.56
  Bottom 0.152: IC4.24 18.73,35.88 75.25,35.88 v75.56,35.56 75.88,35.56 76.52,36.2 87,36.2 v90.81,32.38
BD7  (via drill 0.3)
  Top 0.152: IC6.4 10.78,33.63 IC4.25 | IC1.80 57.66,33.84 58.42,34.61 73.34,34.61 v75.56,36.83 | IC7.4 89.52,32.05 94.93,37.47 94.93,39.05 IC5.25
  Bottom 0.152: IC4.25 20.64,36.51 75.25,36.51 v75.56,36.83 79.69,40.96 94.93,40.96 IC5.25
CE_UART2  (via drill 0.3)
  Top 0.152: IC6.9 IC6.10 7.78,31.59 v7.94,31.75 | v23.81,34.92 25.72,36.83 37.15,36.83 43.82,30.16 43.82,26.99 44.36,26.45 IC1.9
  Bottom 0.152: v7.94,31.75 9.84,33.66 22.54,33.66 v23.81,34.92
CE_UART3  (via drill 0.3)
  Top 0.152: IC7.9 IC7.10 v86.52,31.59 | IC1.76 75.31,32.45 v75.56,32.7
  Bottom 0.152: v75.56,32.7 76.2,33.34 84.77,33.34 v86.52,31.59
CLK_UART  (via drill 0.3)
  Top 0.152: v46.99,26.99 46.99,27.62 46.67,27.94 IC1.6
  Bottom 0.152: IC13.3 46.45,26.45 v46.99,26.99
CTS_RS3
  Top 0.152: U1.GPIO5 62.67,47.51 61.02,49.15 IC3.50
D0  (via drill 0.3)
  Top 0.152: IC2.13 29.23,19.35 v29.85,18.73 | IC1.25 42.13,14.92 39.05,14.92 v34.93,10.79
  Bottom 0.152: X1.10 v34.93,10.79 34.93,13.34 29.85,18.41 v29.85,18.73
D1  (via drill 0.3)
  Top 0.152: X1.11 37.47,9.53 v36.2,10.79 40.01,14.61 47.31,14.61 48.16,15.46 IC1.27 | IC2.14 v31.12,18.73
  Bottom 0.152: v31.12,18.73 31.12,17.78 36.2,12.7 v36.2,10.79
D2  (via drill 0.3)
  Top 0.152: IC2.15 v32.39,18.73 | v37.47,10.79 40.96,14.29 47.62,14.29 48.66,15.32 IC1.28
  Bottom 0.152: X1.12 v37.47,10.79 | 37.47,13.02 v37.47,10.79 | v32.39,18.73 32.39,18.41 37.47,13.34 v37.47,10.79
D3  (via drill 0.3)
  Top 0.152: X1.13 40.01,9.53 v38.73,10.79 41.91,13.97 47.94,13.97 49.16,15.19 IC1.29 | IC2.17 v34.93,18.73
  Bottom 0.152: v34.93,18.73 34.93,16.51 38.73,12.7 v38.73,10.79
D4  (via drill 0.3)
  Top 0.152: IC2.18 v36.2,18.73 | v40.01,11.11 42.55,13.65 48.26,13.65 49.66,15.05 IC1.30
  Bottom 0.152: 40.01,3.81 X1.14 v40.01,11.11 40.01,12.06 36.2,15.88 v36.2,18.73
D5  (via drill 0.3)
  Top 0.152: 42.59,4.82 X1.15 42.55,9.53 v41.28,10.79 43.82,13.34 48.58,13.34 50.66,15.41 IC1.32 | IC2.19 v37.47,18.73
  Bottom 0.152: v37.47,18.73 37.47,15.24 41.28,11.43 v41.28,10.79
D6  (via drill 0.3)
  Top 0.152: 42.59,10.84 v42.55,10.79 44.77,13.02 48.9,13.02 51.16,15.28 IC1.33 | IC2.20 v38.73,18.1
  Bottom 0.152: X1.16 v42.55,10.79 38.73,14.61 v38.73,18.1
D7  (via drill 0.3)
  Top 0.152: X1.17 45.09,9.53 v43.82,10.79 45.72,12.7 49.21,12.7 51.66,15.14 IC1.34 | 40.64,20.62 IC2.21 40.62,18.4 v39.37,17.14
  Bottom 0.152: v43.82,10.79 43.18,11.43 42.55,11.43 39.37,14.61 v39.37,17.14
DA12
  Top 0.152: IC2.4 31.12,29.53 39.37,21.27 41.91,21.27 42.59,21.95 IC1.18
DA13
  Top 0.152: IC1.12 43.95,24.95 42.86,26.04 42.86,28.57 41.91,29.53 IC2.28
DA14
  Top 0.152: IC1.11 44.09,25.45 43.18,26.35 43.18,29.53 41.91,30.8 IC2.29
DA15
  Top 0.152: IC2.3 32.39,29.53 39.37,22.54 42.23,22.54 42.32,22.45 IC1.17
DA16
  Top 0.152: IC2.2 33.66,29.53 39.37,23.81 41.91,23.81 42.78,22.95 IC1.16
DA17
  Top 0.152: IC1.13 43.82,24.45 42.55,25.72 42.55,26.99 41.91,27.62 39.37,27.62 38.73,28.26 IC2.30
DA18
  Top 0.152: IC2.1 34.93,29.53 39.37,25.08 41.91,25.08 43.55,23.45 IC1.15
DCD_RS3
  Top 0.152: U$1.GPIO2 61.61,38.12 60.64,37.15 59.55,37.15 58.67,38.03 U1.GPIO2 57.79,40.65 57.79,46.35 55.88,48.26 46.67,48.26 45.72,47.31 42.23,47.31 41.37,48.16 IC3.42
DSR_RS3  (via drill 0.3)
  Top 0.152: IC3.90 38.37,59.42 40.32,57.47 45.09,57.47 v45.72,58.1
  Bottom 0.152: U1.GPIO13 56.67,56.05 54.61,58.1 v45.72,58.1
DTR_RS3  (via drill 0.3)
  Top 0.152: IC3.87 39.87,60.78 v40.01,60.64
  Bottom 0.152: U1.GPIO12 58.67,55.32 54.93,59.05 43.5,59.05 42.86,59.69 40.96,59.69 v40.01,60.64
E  (via drill 0.3)
  Top 0.152: IC1.22 44.4,19.95 40.32,15.88 34.93,15.88 v34.45,15.4 v29.85,10.79 | v22.23,40.01 22.23,31.75 v25.4,28.57
  Bottom 0.152: X1.6 v29.85,10.79 | IC5.27 94.62,43.81 79.06,43.81 72.39,37.15 25.08,37.15 v22.23,40.01 IC4.27 | v25.4,28.57 26.67,28.57 27.62,27.62 27.62,23.18 31.75,19.05 31.75,18.1 v34.45,15.4
GND  (via drill 0.3, 0.6, 0.61, 0.8)
  Top 1.27: v65.41,10.79 X1.34
  Bottom 1.27: X1.34 v65.41,10.79
  other vias: 46.99,17.78 60.33,17.78 47.62,30.48 60.33,31.11 0.64,13.34 0.64,18.41 0.64,23.5 0.64,28.57 0.64,33.66 0.64,38.73 0.64,43.81 0.64,48.9 0.64,53.98 0.64,59.05 26.04,66.04 76.84,66.04 69.22,66.04 97.16,57.78 97.16,52.7 97.16,46.99 97.16,43.81 97.16,38.73 97.16,33.66 97.16,28.57 97.16,23.5 97.16,17.78 97.16,13.34 20.96,66.04 0.64,66.04 5.72,66.04 97.16,66.04 92.08,66.04 74.3,66.04 0.64,64.14 5.72,13.34 10.8,13.34 15.88,13.34 23.5,11.43 92.08,13.34 87,13.34 81.92,13.34 74.3,11.43 20.96,13.34 76.84,13.34 97.16,62.87 57.47,25.72 41.59,58.42 84.77,29.53 91.76,29.53 84.77,22.54 91.76,22.54 32.39,50.16 46.36,50.16 32.7,64.77 46.67,63.82 49.53,66.04 64.14,66.04 81.6,34.29 86.04,35.24 6.03,29.53 13.02,29.53 13.02,22.54 6.03,22.54 42.55,47.94 34.29,50.48
  pour Top (rank 2): 0,66.67 97.79,66.67 97.79,12.7 75.25,12.7 75.25,10.16 22.54,10.16 22.54,12.7 0,12.7
  pour Bottom (rank 2): 0,66.67 97.79,66.67 97.79,12.7 75.25,12.7 75.25,10.16 22.54,10.16 22.54,12.7 0,12.7
INT_UART2  (via drill 0.3)
  Top 0.152: IC6.30 9.28,23.56 v9.84,24.13 | v24.77,34.92 26.35,36.51 36.83,36.51 43.5,29.84 43.5,26.67 44.22,25.95 IC1.10
  Bottom 0.152: v9.84,24.13 9.84,27.94 15.24,33.34 23.18,33.34 v24.77,34.92
INT_UART3  (via drill 0.3)
  Top 0.152: IC7.30 88.02,20.07 v87.95,20 | IC1.64 73.8,24.95 v75.56,23.18
  Bottom 0.152: v87.95,20 82.23,20 80.96,18.73 80.33,18.73 75.88,23.18 v75.56,23.18
IOR  (via drill 0.3)
  Top 0.152: IC6.20 11,25.29 v11.11,25.4 | IC7.20 v83.07,25.29 | IC1.68 75.53,26.95 v75.56,26.99
  Bottom 0.152: v11.11,25.4 11.75,26.04 20,26.04 27.62,33.66 68.9,33.66 v75.56,26.99 78.74,23.81 81.6,23.81 v83.07,25.29
IOW  (via drill 0.3)
  Top 0.152: IC6.17 11,26.79 v11.11,26.67 | IC7.17 v83.07,26.79 | IC1.71 75.12,28.45 v75.56,28.89
  Bottom 0.152: v11.11,26.67 12.7,28.26 20.96,28.26 26.99,34.29 70.17,34.29 v75.56,28.89 76.2,28.26 81.6,28.26 v83.07,26.79
LED_ACT  (via drill 0.3)
  Top 0.152: v37.47,38.1 37.78,38.1 45.44,30.45 IC1.1
  Bottom 0.152: R5.2 47.31,64.14 46.36,65.09 36.51,65.09 36.2,64.77 36.2,39.37 v37.47,38.1
LED_RXD0
  Top 0.152: R11.2 27.67,63.15 IC3.1
LED_RXD1  (via drill 0.3)
  Top 0.152: IC3.86 40.37,61.55 v40.64,61.28
  Bottom 0.152: R13.2 95.89,59.05 94.93,58.1 93.66,58.1 89.85,54.29 71.75,54.29 66.68,59.37 43.82,59.37 43.18,60.01 41.28,60.01 40.64,60.64 v40.64,61.28
LED_TXD0  (via drill 0.3)
  Top 0.152: R10.2 3.18,61.26 3.18,58.1 4.45,56.83 v6.67,56.83 | v29.85,53.98 30.17,53.65 IC3.20
  Bottom 0.152: v6.67,56.83 8.26,55.24 28.58,55.24 v29.85,53.98
LED_TXD1
  Top 0.152: IC3.74 57.25,62.65 58.74,64.14 R12.2
N$1
  Bottom 0.152: R5.1 ACT.A
N$2
  Top 0.61: IC9.1 2.54,51.44 C16.1
N$3
  Top 0.61: C16.2 4.45,51.44 5.08,52.07 IC9.3
N$4
  Top 0.61: C17.1 6.34,53.43 IC9.4
N$5  (via drill 0.61)
  Top 0.152: IC1.45 57.16,17.79 TDI.TP
  other vias: 57.47,18.1
N$6  (via drill 0.61)
  Top 0.152: IC1.47 58.16,19.95 TMS.TP
  other vias: 57.47,20.64
N$7  (via drill 0.61)
  Top 0.152: IC1.48 58.66,21.99 TCK.TP
  other vias: 57.47,23.18
N$8  (via drill 0.61)
  Top 0.152: IC1.83 56.16,31.47 56.83,30.8 TDO.TP
  other vias: 57.47,30.8
N$9
  Top 0.61: IC9.5 7.62,51.45 C17.2
N$10  (via drill 0.3)
  Top 0.152: v92.71,61.91 R4.2 92.71,61.76 92.71,61.59 93.34,60.96 93.34,55.24 93.98,54.61 IC10.7
  Bottom 0.152: R1.2 R3.2 90.34,59.22 92.71,61.59 v92.71,61.91
N$11  (via drill 0.6)
  Top 0.152: IC3.83 41.87,63.78 TDO1.TP
  other vias: 41.59,63.5
N$12  (via drill 0.6)
  Top 0.152: IC3.45 42.87,50.16 42.23,50.8 TDI1.TP
  other vias: 41.59,50.8
N$13
  Top 0.61: IC11.1 73.65,53.43 C1.1
N$14
  Top 0.61: C18.1 2.87,55.87 3.81,54.93 IC9.2
N$15
  Top 0.61: IC9.6 8.89,52.07 9.53,51.44 C19.2
N$16
  Top 0.61: IC8.1 15.24,51.45 C20.1
N$17
  Top 0.61: C1.2 75.56,51.44 76.2,52.07 IC11.3
N$18
  Top 0.61: IC11.4 77.47,51.45 C2.1
N$19
  Top 0.61: IC11.5 78.74,51.45 C2.2
N$20
  Top 0.61: C10.1 73.99,55.87 74.93,54.93 IC11.2
N$21
  Top 0.61: IC11.6 80.01,52.07 80.65,51.44 C11.2
N$22
  Top 0.61: IC10.1 86.36,51.45 C12.1
N$23
  Top 0.61: C12.2 88.27,51.44 88.9,52.07 IC10.3
N$24
  Top 0.61: IC10.4 90.17,51.45 C13.1
N$25
  Top 0.61: C20.2 17.15,51.44 17.78,52.07 IC8.3
N$26
  Top 0.61: IC8.4 19.05,51.45 C21.1
N$27
  Top 0.61: IC8.5 20.32,51.45 C21.2
N$28
  Top 0.61: C22.1 15.57,55.87 16.51,54.93 IC8.2
N$29
  Top 0.61: IC8.6 21.59,52.07 22.23,51.44 C23.2
N$30  (via drill 0.6)
  Top 0.152: IC3.47 43.87,51.06 TMS1.TP
  other vias: 41.59,53.34
N$31  (via drill 0.3)
  Top 0.152: IC8.7 22.86,54.61 22.23,55.24 22.23,60.96 21.44,61.75 R9.2 v21.59,61.91
  Bottom 0.152: R7.2 R8.2 19.22,59.22 21.59,61.59 v21.59,61.91
N$32  (via drill 0.6)
  Top 0.152: IC3.48 44.37,53.1 TCK1.TP
  other vias: 41.59,55.88
N$33
  Top 0.152: IC6.5 10.28,29.32 10.16,29.21 6.99,29.21 6.78,29.42 IC6.12
N$34
  Top 0.61: IC10.5 91.44,51.45 C13.2
N$35
  Top 0.152: IC7.12 85.52,29.74 85.72,29.53 88.9,29.53 89.02,29.64 IC7.5
N$36
  Top 0.61: C14.1 86.69,55.87 87.63,54.93 IC10.2
N$37
  Top 0.61: IC10.6 92.71,52.07 93.34,51.44 C15.2
N$38
  Top 0.152: R10.1 1.6,64.14 TXD0.A
N$39
  Top 0.152: RXD0.A R11.1
N$40
  Top 0.152: TXD1.A R12.1
N$41
  Bottom 0.152: RXD1.A 95.89,62.87 R13.1
N$46
  Top 0.152: U1.GPIO0 60.67,43.18 | 60.67,43.18 60.67,46.65 58.74,48.58 46.36,48.58 45.72,47.94 45.09,47.94 44.87,48.16 IC3.49 | U$1.GPIO0 60.59,43.1 60.67,43.18
N$48
  Top 0.152: IC3.41 40.87,48.03 41.91,46.99 46.04,46.99 46.99,47.94 53.34,47.94 55.25,46.04 55.25,41.59 56.67,40.17 U1.GPIO15
N$52  (via drill 0.3)
  Top 0.152: IC3.91 37.87,59.28 40.01,57.15 v45.72,57.15
  Bottom 0.152: U1.GPIO16 61.28,52.39 56.52,52.39 55.56,53.34 55.56,56.52 54.29,57.78 46.36,57.78 v45.72,57.15
N$53
  Top 0.152: U1.CH_PD 63.6,52.7 58.42,52.7 57.79,53.34 57.79,55.56 55.7,57.65 IC3.64
Q
  Top 0.152: X1.7 32.39,9.53 31.75,10.16 31.75,11.11 36.2,15.56 40.64,15.56 44.53,19.45 IC1.23
R/!W  (via drill 0.3)
  Top 0.152: v35.24,21.27 35.24,23.5 32.39,26.35 26.67,26.35 21.59,31.43 v21.59,43.18 | v45.09,10.79 46.67,12.38 49.53,12.38 52.16,15.01 IC1.35
  Bottom 0.152: v35.24,21.27 37.15,19.37 38.42,19.37 41.91,15.88 41.91,13.34 43.5,11.75 44.13,11.75 v45.09,10.79 X1.18 | IC5.28 92.39,44.13 78.74,44.13 72.07,37.47 27.31,37.47 v21.59,43.18 IC4.28
RESET  (via drill 0.3)
  Top 0.152: IC7.35 90.52,20.98 v90.49,20.95 | IC6.35 11.78,20.93 12.07,20.64 v13.65,20.64 | IC1.65 74.25,25.45 v75.56,24.13
  Bottom 0.152: v13.65,20.64 17.46,20.64 18.1,21.27 18.1,22.23 28.58,32.7 66.99,32.7 v75.56,24.13 78.74,20.95 v90.49,20.95
RI_RS3  (via drill 0.3)
  Top 0.152: IC3.89 38.87,60.46 38.73,60.33 38.73,59.69 39.05,59.37 v40.01,59.37
  Bottom 0.152: v40.01,59.37 42.55,59.37 43.18,58.74 54.61,58.74 57.79,55.56 57.79,53.34 58.42,52.7 59.92,52.7 60.67,53.45 U1.GPIO14
RS_CTS0  (via drill 0.3)
  Top 0.152: IC9.13 v6.35,59.69
  Bottom 0.152: v6.35,59.69 8.26,61.59 12.07,61.59 R7.1 12.07,64.66 X2.8
RS_CTS1  (via drill 0.3)
  Top 0.152: v77.47,59.69 IC11.13
  Bottom 0.152: v77.47,59.69 79.84,62.06 R1.1 83.08,62.17 X3.8
RS_DCD0  (via drill 0.3)
  Top 0.152: IC8.13 v19.05,60.33
  Bottom 0.152: X2.6 17.45,62.08 R8.1 17.46,61.91 v19.05,60.33
RS_DCD1  (via drill 0.3)
  Top 0.152: IC10.13 v90.17,60.33
  Bottom 0.152: v90.17,60.33 90.17,60.48 R3.1 88.57,62.08 X3.6
RS_DSR0
  Top 0.152: X2.1 18.82,64.53 18.97,64.53 20.32,63.18 23.01,63.18 R9.1 24.28,61.75 23.5,60.96 23.5,55.24 24.13,54.61 IC8.8
RS_DSR1
  Top 0.152: 90.56,64.14 X3.1 91.52,63.18 94.3,63.18 95.4,62.08 R4.1 95.4,61.75 94.62,60.96 94.62,55.24 95.25,54.61 IC10.8
RS_DTR0
  Top 0.152: IC9.14 5.08,60.96 5.72,61.59 7.94,61.59 10.48,64.14 10.48,64.64 X2.4
RS_DTR1
  Top 0.152: X3.4 81.71,64.25 79.06,61.59 76.84,61.59 76.2,60.96 IC11.14
RS_RTS0  (via drill 0.3)
  Top 0.152: v15.88,61.59 17.15,61.59 17.78,60.96 IC8.14
  Bottom 0.152: X2.7 14.71,62.76 v15.88,61.59
RS_RTS1  (via drill 0.3)
  Top 0.152: v87,61.59 88.27,61.59 88.9,60.96 IC10.14
  Bottom 0.152: X3.7 85.83,62.76 v87,61.59
RS_RXD0
  Top 0.152: X2.2 16.08,64.02 12.38,60.33 12.38,55.56 11.43,54.61 IC9.8
RS_RXD1
  Top 0.152: X3.2 87.2,64.02 83.5,60.33 83.5,55.56 82.55,54.61 IC11.8
RS_TXD0
  Top 0.152: X2.3 13.34,63.5 10.8,60.96 10.8,55.24 10.16,54.61 IC9.7
RS_TXD1
  Top 0.152: X3.3 84.46,63.5 81.92,60.96 81.92,55.24 81.28,54.61 IC11.7
RTS_RS3
  Top 0.152: IC3.52 48.36,51.65 50.48,49.53 62.87,49.53 65.09,47.31 65.09,40.64 64.67,40.22 U1.GPIO4
RXD0  (via drill 0.3)
  Top 0.152: IC9.9 11.43,57.15 v11.75,56.83 | IC3.95 35.87,61.91 v34.29,60.33
  Bottom 0.152: v34.29,60.33 30.8,56.83 v11.75,56.83
RXD1  (via drill 0.3)
  Top 0.152: IC11.9 v82.55,56.83 | IC3.79 43.87,62.81 v45.72,60.96
  Bottom 0.152: v82.55,56.83 81.28,55.56 73.03,55.56 67.95,60.64 46.04,60.64 v45.72,60.96
RXD_RS3
  Top 0.152: IC3.53 48.5,52.15 50.8,49.85 63.18,49.85 66.67,46.37 U1.RX
  Bottom 0.152: U$1.RX 57.56,44.13 65.09,44.13 66.67,42.55 U1.RX
SW1  (via drill 0.3)
  Top 0.152: v72.71,53.66 v72.71,51.75 | v72.71,40.64 67.31,35.24 57.79,35.24 56.66,34.12 IC1.82
  Bottom 0.152: S3.3 67.95,57.47 71.44,53.98 72.39,53.98 v72.71,53.66 | v72.71,51.75 72.71,45.4 | 72.71,45.4 v72.71,40.64 | R6.1 77.77,45.4 72.71,45.4
TXD0  (via drill 0.3)
  Top 0.152: IC9.10 v10.16,56.83 | IC3.94 36.37,61.45 v34.29,59.37
  Bottom 0.152: v10.16,56.83 10.8,56.2 31.12,56.2 v34.29,59.37
TXD1  (via drill 0.3)
  Top 0.152: IC11.10 v81.28,56.83 | IC3.78 44.37,63.26 v45.72,61.91
  Bottom 0.152: v81.28,56.83 80.33,55.88 73.34,55.88 68.26,60.96 46.67,60.96 v45.72,61.91
TXD_RS3
  Top 0.152: IC3.54 48.63,52.65 51.12,50.16 63.5,50.16 68.67,45 U1.TX
  Bottom 0.152: U$1.TX 68.67,41.13 U1.TX
UART_1_3
  Top 0.152: IC1.2 46.46,29.95 46.67,30.16 46.67,30.8 46.36,31.11 45.4,31.11 29.85,46.67 29.85,52.07 30.43,52.65 IC3.22
UART_2_4
  Top 0.152: IC1.3 46.59,29.45 46.99,29.84 46.99,31.11 46.67,31.43 45.72,31.43 30.16,46.99 30.16,51.75 30.56,52.15 IC3.23
UART_CLK  (via drill 0.3)
  Top 0.152: IC6.14 11.09,28.29 v11.11,28.26 | IC7.14 82.84,28.29 v82.87,28.26 | IC1.72 74.67,28.95 v75.56,29.84
  Bottom 0.152: v11.11,28.26 11.43,28.57 20.64,28.57 26.67,34.61 70.8,34.61 v75.56,29.84 76.84,28.57 82.55,28.57 v82.87,28.26
UART_CLK0  (via drill 0.3)
  Top 0.152: v22.86,34.92 25.08,37.15 37.47,37.15 44.13,30.48 44.13,27.3 44.49,26.95 IC1.8
  Bottom 0.152: IC4.6 2.86,33.97 21.91,33.97 v22.86,34.92
UART_CLK1  (via drill 0.3)
  Top 0.152: IC1.78 58.66,33.58 59.06,33.97 74.93,33.97 v75.56,34.61
  Bottom 0.152: v75.56,34.61 75.88,34.92 IC5.6
UART_RXD0
  Top 0.152: IC4.12 4.13,21.91 4.13,47.31 5.72,48.9 26.04,48.9 26.35,49.21 26.35,57.47 28.04,59.15 IC3.9
UART_RXD1
  Top 0.152: IC5.12 78.11,22.23 78.11,40.01 65.72,52.39 56.83,52.39 55.56,53.66 55.56,55.56 53.98,57.15 IC3.63
UART_RXD2
  Top 0.152: IC6.7 9.28,38.8 16.83,46.35 17.78,46.35 19.69,48.26 26.67,48.26 26.99,48.58 26.99,56.83 28.31,58.15 IC3.11
UART_TXD0
  Top 0.152: IC4.10 3.49,26.35 3.49,47.94 5.08,49.53 25.4,49.53 25.72,49.85 25.72,58.1 28.27,60.65 IC3.6
UART_TXD1
  Top 0.152: IC5.10 79.06,26.35 79.06,40.96 69.53,50.48 69.53,57.47 66.99,60.01 49.21,60.01 48.36,59.15 IC3.67
UART_TXD2
  Top 0.152: IC6.8 8.78,38.94 16.51,46.67 17.46,46.67 19.37,48.58 26.35,48.58 26.67,48.9 26.67,57.15 28.17,58.65 IC3.10
USER0
  Top 0.152: IC1.99 48.16,33.44 47.94,33.66 44.13,33.66 31.37,46.42 IC3.25
USER1
  Top 0.152: IC1.97 49.16,33.39 48.58,33.97 44.45,33.97 33.87,44.55 IC3.27
USER2
  Top 0.152: IC1.96 49.66,33.53 48.9,34.29 44.77,34.29 34.37,44.69 IC3.28
USER3
  Top 0.152: IC1.95 50.16,33.66 49.21,34.61 45.09,34.61 34.87,44.82 IC3.29
USER4
  Top 0.152: IC1.94 50.66,33.8 49.53,34.92 45.4,34.92 35.37,44.96 IC3.30
USER5
  Top 0.152: IC1.93 51.16,33.93 49.85,35.24 45.72,35.24 36.37,44.59 IC3.32
USER6
  Top 0.152: IC1.92 51.66,34.07 50.17,35.56 46.04,35.56 36.87,44.73 IC3.33
USER7
  Top 0.152: IC1.91 52.16,34.2 50.48,35.88 46.36,35.88 37.87,44.36 IC3.35
USER8
  Top 0.152: IC1.90 52.66,34.34 50.8,36.2 46.67,36.2 38.37,44.5 IC3.36
USER9
  Top 0.152: IC1.89 53.16,34.47 51.12,36.51 46.99,36.51 38.87,44.63 IC3.37
USER10
  Top 0.152: IC1.87 54.16,35.38 51.75,37.78 47.31,37.78 39.87,45.22 IC3.39
USER11
  Top 0.152: IC1.86 54.66,35.51 52.07,38.1 47.62,38.1 40.37,45.35 IC3.40
VCC  (via drill 0.3)
  Top 0.152: R2.2 IC4.15 | IC6.42 IC6.41 | IC7.42 IC7.41
  Top 0.178: IC6.42 12.77,25.79 v11.11,24.13 | IC7.42 93.59,25.79 v93.66,25.72
  Top 0.305: C12.1.1
  Top 0.406: v26.35,27.94 26.35,33.97 28.26,35.88 36.21,35.88 C2.1.1 36.21,32.62 IC2.32
  Top 0.61: X1.9 34.93,9.53 v33.66,10.79 | C10.2 71.75,57.78 v73.66,57.78 IC11.16 | C14.2 v84.46,57.78 86.36,57.78 | IC10.16 86.36,57.78 | C22.2 v13.34,57.78 15.24,57.78 IC8.16 | C18.2 0.64,57.78 v2.54,57.78 IC9.16 | v92.08,55.56 92.08,57.78 86.36,57.78 | v90.49,35.24 90.58,35.24 IC12.3 v90.49,35.23 90.49,33.97 89.85,33.34 85.09,33.34 82.55,35.88 82.55,45.09 IC5.2 | v5.72,45.09 v5.72,32.38
  Bottom 0.152: 11.11,22.54 11.11,22.23 11.11,21.91 14.61,18.41 | R6.2 IC5.2
  Bottom 0.178: v11.11,24.13 11.11,22.54 | C6.1.1 11.13,22.23 11.11,22.23 | C7.1.1 v93.66,25.72
  Bottom 0.406: 23.5,18.41 23.5,25.08 v26.35,27.94
  Bottom 0.61: v33.66,10.79 29.85,14.61 C12.1.1 23.5,14.61 | 23.5,14.61 IC4.15 | v84.46,57.78 v73.66,57.78 66.36,65.09 56.2,65.09 55.88,65.41 52.07,65.41 51.75,65.09 47.31,65.09 46.67,65.72 32.39,65.72 31.75,65.09 26.35,65.09 25.4,64.14 25.4,61.59 24.13,60.33 21.59,60.33 19.05,57.78 v13.34,57.78 5.72,57.78 | v2.54,57.78 5.72,57.78 | 23.5,14.61 23.5,18.41 14.61,18.41 5.08,18.41 5.08,31.75 v5.72,32.38 | IC5.15 93.66,14.61 v93.66,25.72 93.66,35.24 v90.49,35.24 | v92.08,55.56 92.08,45.09 IC5.2 82.23,45.09 C5.1.1 | IC4.2 1.91,45.07 C4.1.1 5.72,45.07 v5.72,45.09 5.72,57.78
  other vias: 26.04,14.61